# EAGLE design GPIOexpander_4 (EAGLE 6.0)
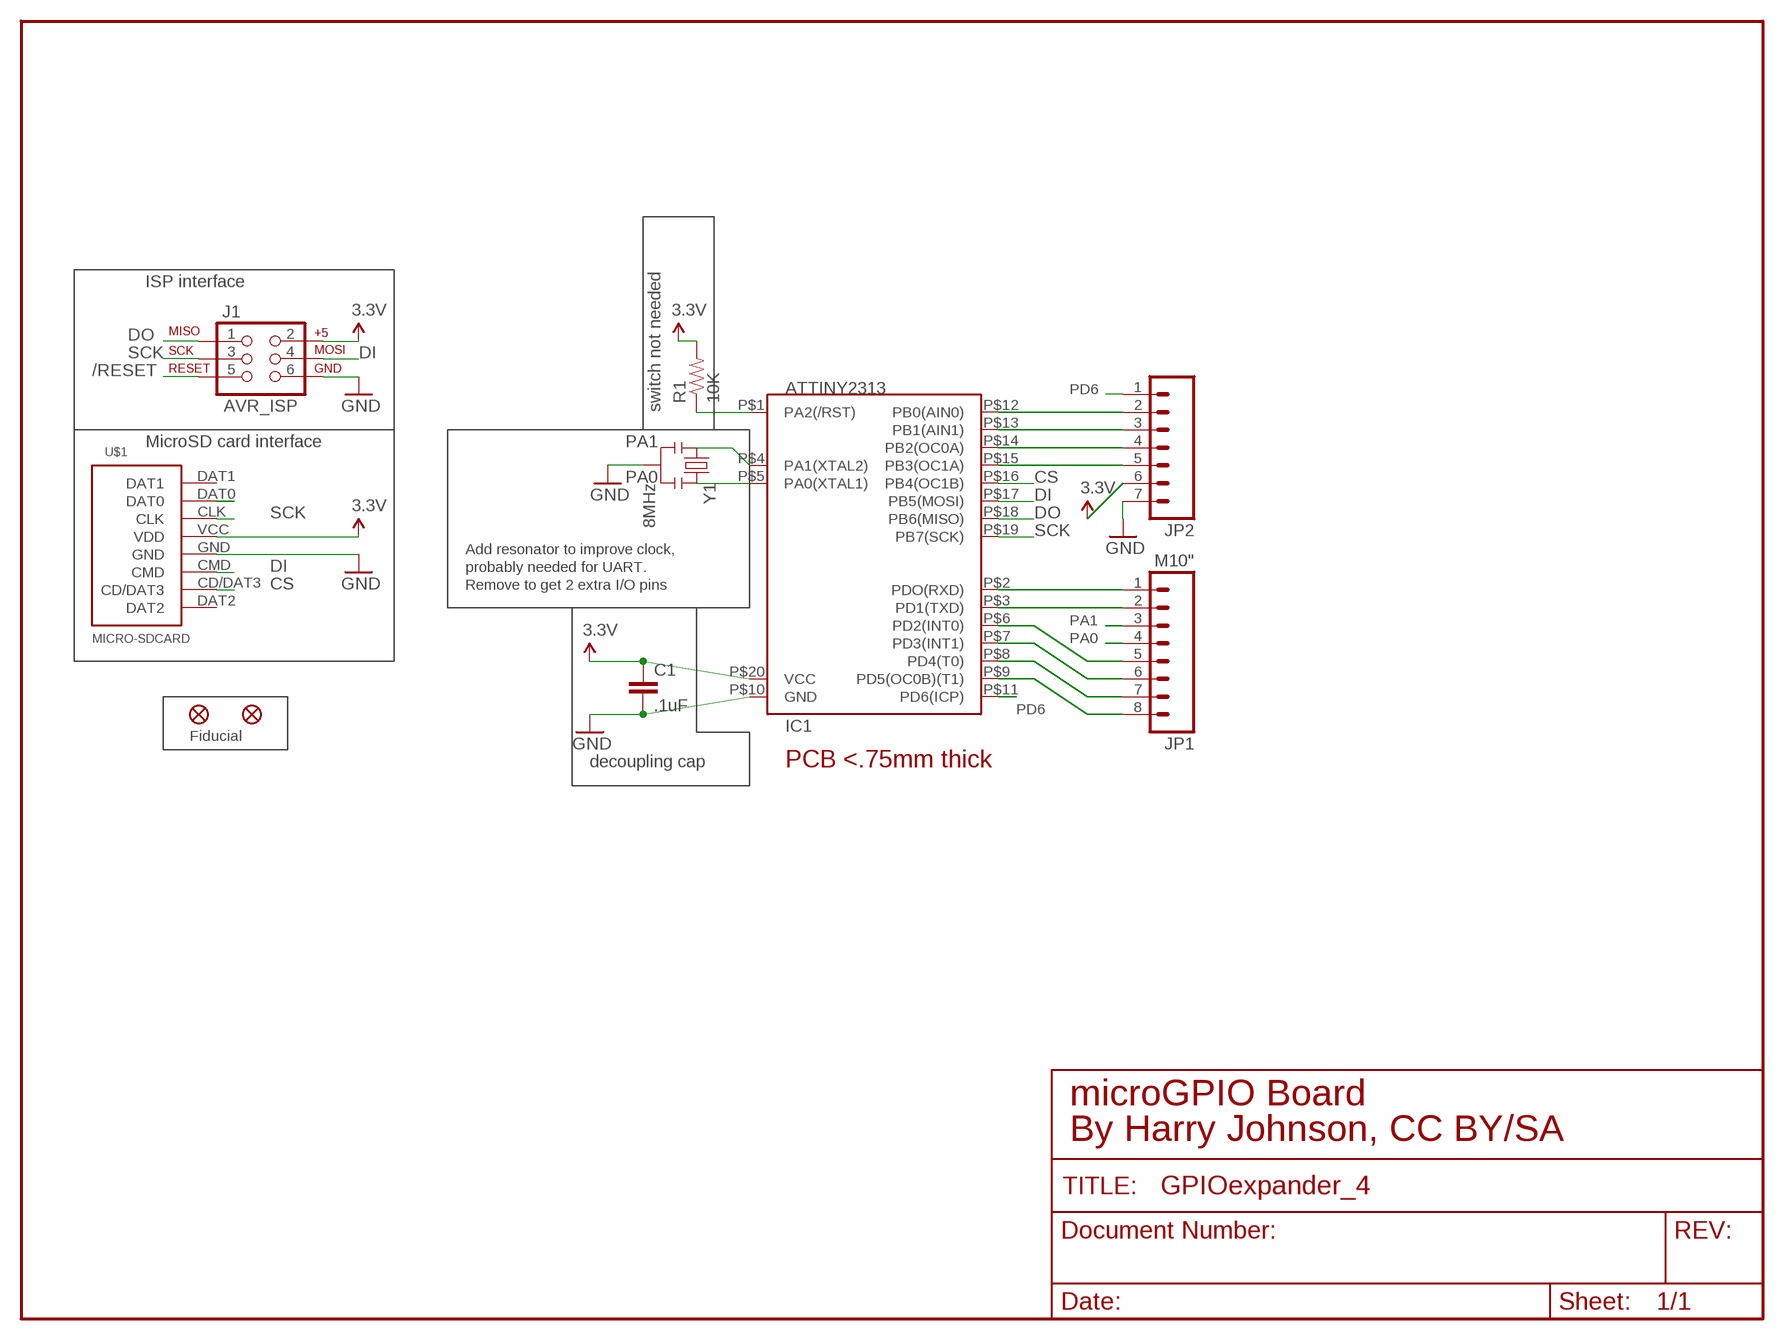
[diagram p0: schematic, sheet 1]

## Parts
C1  .1uF  CAP0805  [0805]
IC1  ATTINY2313  ATTINY2313SOIC  [SO20W]
J1  AVR_ISP  AVR_SPI_PRG_6NS  [2X3-NS]
JP1  M10"  M08  [1X08]
JP2  M07  [1X07]
R1  10K  RESISTOR  [0805]
U$1  MICRO-SDCARD  [MICRO-SDCARD]
U$2  FIDUCIAL1X2.5  [FIDUCIAL-1X2.5]
U$3  FIDUCIAL1X2.5  [FIDUCIAL-1X2.5]
Y1  8MHz  RESONATORSMD  [RESONATOR-SMD]

## Nets
3.3V: C1.1 IC1.P$20(VCC) J1.2 JP2.6 R1.2 U$1.VCC(VDD)
/RESET: IC1.P$1(PA2(/RST)) J1.5 R1.1
CS: IC1.P$16(PB4(OC1B)) U$1.CD/DAT3
DI: IC1.P$17(PB5(MOSI)) J1.4 U$1.CMD
DO: IC1.P$18(PB6(MISO)) J1.1 U$1.DAT0
GND: C1.2 IC1.P$10(GND) J1.6 JP2.7 U$1.GND Y1.2
PA0: IC1.P$5(PA0(XTAL1)) JP1.4 Y1.3
PA1: IC1.P$4(PA1(XTAL2)) JP1.3 Y1.1
PB0: IC1.P$12(PB0(AIN0)) JP2.2
PB1: IC1.P$13(PB1(AIN1)) JP2.3
PB2: IC1.P$14(PB2(OC0A)) JP2.4
PB3: IC1.P$15(PB3(OC1A)) JP2.5
PD0: IC1.P$2(PDO(RXD)) JP1.1
PD1: IC1.P$3(PD1(TXD)) JP1.2
PD2: IC1.P$6(PD2(INT0)) JP1.5
PD3: IC1.P$7(PD3(INT1)) JP1.6
PD4: IC1.P$8(PD4(T0)) JP1.7
PD5: IC1.P$9(PD5(OC0B)(T1)) JP1.8
PD6: IC1.P$11(PD6(ICP)) JP2.1
SCK: IC1.P$19(PB7(SCK)) J1.3 U$1.CLK
Unconnected: U$1.DAT1 U$1.DAT2

## Notes on the sheet
- ISP interface
- switch not needed
- MicroSD card interface
- Add resonator to improve clock,
- probably needed for UART.
- Remove to get 2 extra I/O pins
- Fiducial
- decoupling cap | PCB <.75mm thick
- microGPIO Board
- By Harry Johnson, CC BY/SA

## Library data of the parts
C1 = SparkFun:CAP: Capacitor Standard 0603 ceramic capacitor, and 0.1" leaded capacitor.
IC1 = SparkFun:ATTINY2313
J1 = SparkFun:AVR_SPI_PRG_6: AVR ISP 6 Pin This is the reduced ISP connector for AVR programming. Common on Arduino. This footprint will take up less PCB space and can be used with a 10-pin to 6-pin adapter such as SKU: BOB-08508
JP1 = SparkFun:M08: Header 8 Standard 8-pin 0.1" header. Use with straight break away headers (SKU : PRT-00116), right angle break away headers (PRT-00553), swiss pins (PRT-00743), machine pins (PRT-00117), and female headers (PRT-00115).
JP2 = SparkFun:M07: Header 7 Standard 7-pin 0.1" header. Use with straight break away headers (SKU : PRT-00116), right angle break away headers (PRT-00553), swiss pins (PRT-00743), machine pins (PRT-00117), and female headers (PRT-00115). NOTES ON THE VARIANTS LOCK and LOCK_LONGPADS... This footprint was designed to help hold the alignment of a through-hole component (i.e. 7-pin header) while soldering it into place. You may notice that each hole has been shifted either up or down by 0.005 of an inch from it's more standard position (which is usually a perfectly straight line). This slight alteration caused the pins (the squares in the middle) to touch the edges of the holes. Because they are alternating, it causes a "brace" to hold the header in place. 0.005 has proven to be the perfect amount of "off-center" position when using our standard breakaway headers. Although looks a little odd when you look at the bare footprint, once you have a header in there, the alteration is very hard to notice. Also, if you push a header all the way into place, it is covered up entirely on the bottom side. This idea of altering the position of holes to aid alignment will be further integrated into the Sparkfun Library for other footprints. It can help hold any component with 3 or more connection pins.
R1 = SparkFun:RESISTOR: Resistor Basic schematic elements and footprints for 0603, 1206, and PTH 1/10th watt (small) resistors.
U$1 = SparkFun_2:MICRO-SDCARD
U$2 U$3 = SparkFun:FIDUCIAL: Fiducial Alignment Points Various fiducial points for machine vision alignment.
Y1 = SparkFun:RESONATOR: Resonator Small SMD resonator. This is the itty bitty 10/20MHz resonators with built in caps. CSTCE10M0G55 and CSTCE20M0V53. Footprint has been reviewed closely but hasn't been tested yet.

## Board
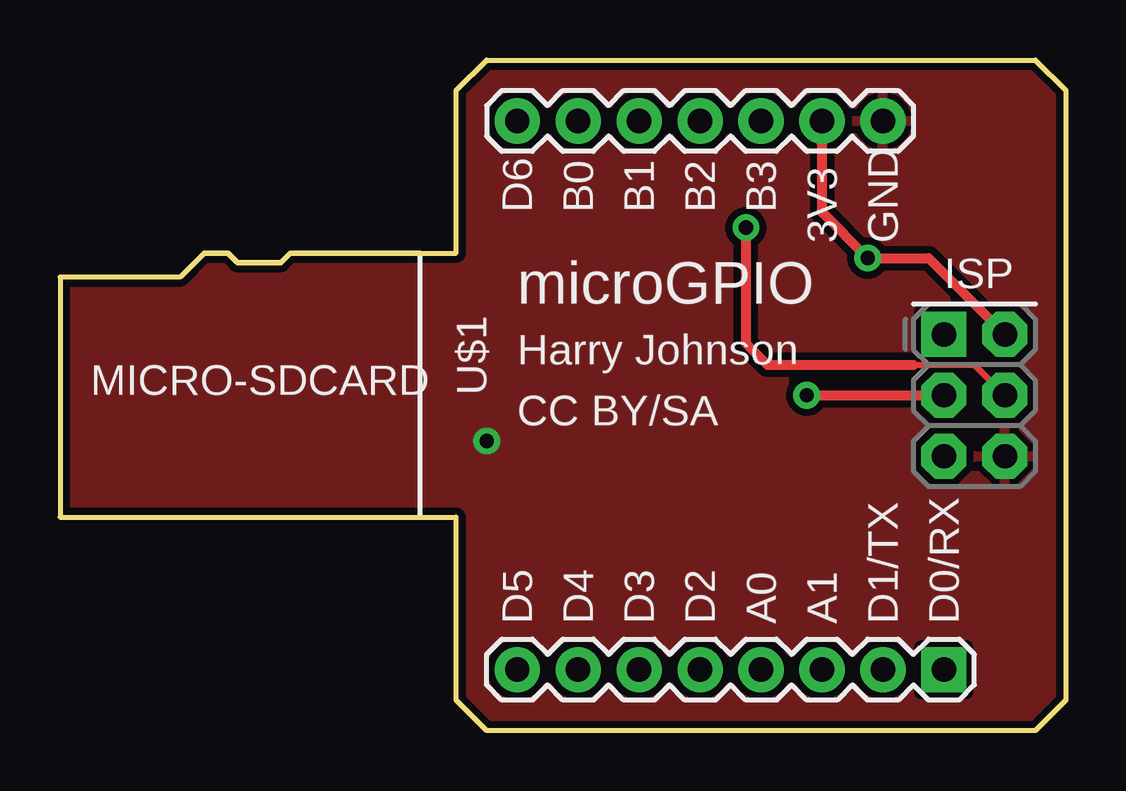
[diagram p1: board, top side]
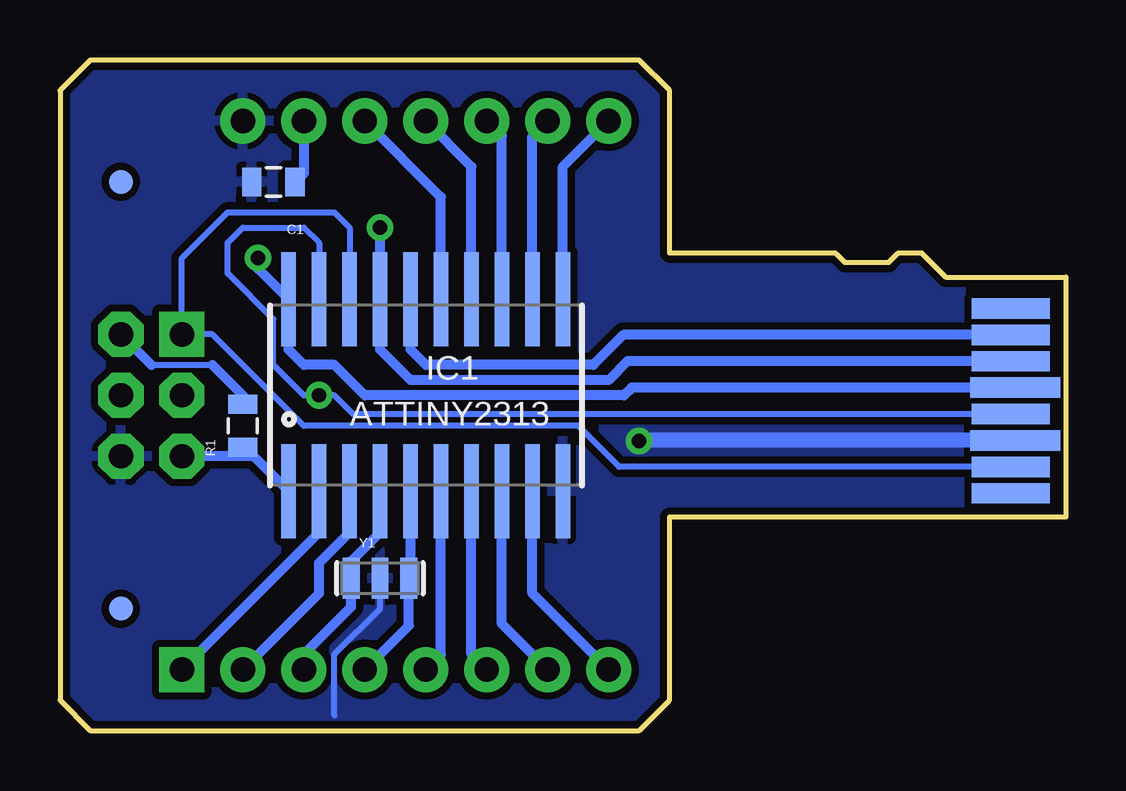
[diagram p2: board, bottom side, seen from below]

Size 41.91 x 27.94 mm. Coordinates in mm from the lower left corner, seen from the top.
Outline: 9.6,19.89 16.51,19.89 16.51,26.67 17.78,27.94 40.64,27.94 41.91,26.67 41.91,1.27 40.64,0 17.78,0 16.51,1.27 16.51,8.89 0,8.89 0,18.89 5,18.89 6,19.89 7,19.89 7.39,19.5 9.2,19.5 9.58,19.87
Copper layers (1*16): Top 0.035mm / dielectric 1.5mm / Bottom 0.035mm
Design rules: minimum track width 8mil, minimum drill 20mil, track to track 8mil, track to pad 8mil, pad to pad 8mil, via to via 8mil, smd to smd 8mil, copper to edge 10mil, drill to drill 8mil, minimum pad ring 12mil, minimum via ring 10mil, stop-mask expansion 4mil, vias tented up to drill 25mil, thermal gap 10mil

### Footprints (pad centres in the part's own frame; a part is rotated, then mirrored left to right if it is on the bottom)
0805 = smd 0.8 x 1.2: 1 -0.9,0; 2 0.9,0
SO20W = smd 0.6 x 3.9: P$1 -5.715,-4; P$2 -4.445,-4; P$3 -3.175,-4; P$4 -1.905,-4; P$5 -0.635,-4; P$6 0.635,-4; P$7 1.905,-4; P$8 3.175,-4; P$9 4.445,-4; P$10 5.715,-4; P$11 5.715,4; P$12 4.445,4; P$13 3.175,4; P$14 1.905,4; P$15 0.635,4; P$16 -0.635,4; P$17 -1.905,4; P$18 -3.175,4; P$19 -4.445,4; P$20 -5.715,4
2X3-NS = drill 1.016 pad 1.88 square: 1 -2.54,-1.27 | drill 1.016 pad 1.88 octagon: 2 -2.54,1.27; 3 0,-1.27; 4 0,1.27; 5 2.54,-1.27; 6 2.54,1.27
1X08 = drill 1.016 pad 1.88 square: 1 0,0 | drill 1.016 pad 1.88: 2 2.54,0; 3 5.08,0; 4 7.62,0; 5 10.16,0; 6 12.7,0; 7 15.24,0; 8 17.78,0
1X07 = drill 1.016 pad 1.88: 1 0,0; 2 2.54,0; 3 5.08,0; 4 7.62,0; 5 10.16,0; 6 12.7,0; 7 15.24,0
MICRO-SDCARD = smd 0.85 x 3.25 bottom: CD/DAT3 2.56,2.3; CLK 5.86,2.3; CMD 3.66,2.3; DAT0 8.06,2.3; DAT1 9.16,2.3; DAT2 1.46,2.3 | smd 0.85 x 3.75 bottom: GND 6.96,2.1; VCC 4.76,2.1
FIDUCIAL-1X2.5 = smd 1 x 1: 1 0,0
RESONATOR-SMD = smd 0.7 x 1.7: 1 -1.2,0; 2 0,0; 3 1.2,0

### Placement (x,y rotation side)
C1  33.02,22.86 180 bottom
IC1  26.67,13.97 0 bottom
J1  38.1,13.97 270 top
JP1  36.83,2.54 180 top
JP2  19.05,25.4 0 top
R1  34.29,12.7 90 bottom
U$1  0,19.05 270 top
U$2  39.37,22.86 0 bottom
U$3  39.37,5.08 0 bottom
Y1  28.57,6.35 0 bottom

### Tracks (layer width: path | path; a pad name or v marks a point on that pad's centre or on a via)
3.3V  (via drill 0.6)
  Top 0.406: J1.2 36.2,19.68 v33.66,19.68 31.75,21.59 JP2.6
  Bottom 0.254: 38.1,15.24 35.56,15.24
  Bottom 0.406: U$1.VCC 18.09,14.29 18.41,13.97 29.21,13.97 30.48,15.24 31.75,15.24 32.38,15.88 IC1.P$20 33.66,19.24 v33.66,19.68 | C1.1 31.75,23.23 JP2.6 | R1.2 34.29,13.97 35.56,15.24 | J1.2 38.1,15.24
/RESET
  Bottom 0.406: 34.29,11.43 33.84,11.43 IC1.P$1 | 34.29,11.43 J1.5 | 34.29,11.43 R1.1
CS
  Bottom 0.406: U$1.CD/DAT3 18.43,16.49 19.68,15.24 26.67,15.24 27.3,15.88 IC1.P$16
DI  (via drill 0.6)
  Top 0.254: 35.56,15.24 38.1,15.24 J1.4
  Top 0.406: v28.57,20.95 28.57,16.14 29.47,15.24 35.56,15.24
  Bottom 0.406: U$1.CMD 18.27,15.39 19.05,14.61 27.3,14.61 28.57,15.88 | 28.57,15.88 IC1.P$17 | 28.57,15.88 v28.57,20.95
DO
  Bottom 0.254: IC1.P$18 29.84,20.95 30.48,21.59 34.92,21.59 36.83,19.68 J1.1 35.56,16.51 31.75,12.7 20.32,12.7 18.61,10.99 U$1.DAT0
GND  (via drill 0.6)
  Bottom 0.254: Y1.2 28.57,5.08 30.48,3.17 30.48,0.64
  Bottom 0.635: U$1.GND 17.75,12.09 v17.78,12.06
  pour Bottom (isolate 0.305): 0,0 0,27.94 41.91,27.94 41.91,0
  pour Top (isolate 0.305): 0,0 0,27.94 41.91,27.94 41.91,0
PA0
  Bottom 0.406: IC1.P$5 27.3,6.42 Y1.3 27.38,4.38 JP1.4
PA1
  Bottom 0.406: IC1.P$4 28.57,8.26 29.77,7.05 Y1.1 29.77,5.15 31.75,3.17 JP1.3
PB0
  Bottom 0.406: IC1.P$12 22.23,24.77 JP2.2
PB1
  Bottom 0.406: IC1.P$13 23.5,24.77 JP2.3
PB2
  Bottom 0.406: IC1.P$14 24.77,23.5 JP2.4
PB3
  Bottom 0.406: IC1.P$15 26.04,22.23 JP2.5
PD0
  Bottom 0.406: IC1.P$2 31.11,8.26 JP1.1
PD1
  Bottom 0.406: IC1.P$3 29.84,8.26 31.11,6.99 31.11,5.71 JP1.2
PD2
  Bottom 0.406: IC1.P$6 26.04,3.17 JP1.5
PD3
  Bottom 0.406: IC1.P$7 24.77,3.17 JP1.6
PD4
  Bottom 0.406: IC1.P$8 23.5,4.45 JP1.7
PD5
  Bottom 0.406: IC1.P$9 22.23,5.71 JP1.8
PD6
  Bottom 0.406: IC1.P$11 20.95,23.5 JP2.1
SCK  (via drill 0.6)
  Top 0.406: v31.11,13.97 J1.3
  Bottom 0.254: IC1.P$19 31.11,20.32 31.75,20.95 34.29,20.95 34.92,20.32 34.92,19.05 33.02,17.14 33.02,15.24 31.75,13.97 v31.11,13.97 30.48,13.97 29.7,13.19 U$1.CLK

### Text on the board
tPlace: D6 | B0 | B1 | B2 | B3 | 3V3 | GND | microGPIO | ISP | Harry Johnson | CC BY/SA | D5 | D4 | D3 | D2 | A0 | A1 | D1/TX | D0/RX
bPlace: ATTINY2313